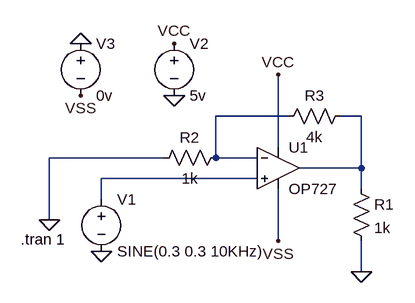
[diagram p0: schematic 6531313221-PB3.asc]
6531313221-PB3.asc, the LTspice schematic file:
Version 4
SHEET 1 880 680
WIRE 64 48 -48 48
WIRE 176 48 144 48
WIRE 48 96 48 -16
WIRE -128 112 -304 112
WIRE -48 112 -48 48
WIRE 16 112 -48 112
WIRE 176 128 176 48
WIRE 176 128 80 128
WIRE 16 144 -224 144
WIRE 176 160 176 128
WIRE -224 176 -224 144
WIRE -304 208 -304 112
WIRE 48 240 48 160
WIRE 176 288 176 240
FLAG 176 288 0
FLAG -304 208 0
FLAG 48 -16 VCC
FLAG -112 -64 VCC
FLAG -112 16 0
FLAG -256 -64 0
FLAG -256 16 VSS
FLAG -224 256 0
FLAG 48 240 VSS
SYMBOL res 160 144 R0
SYMATTR InstName R1
SYMATTR Value 1k
SYMBOL voltage -224 160 R0
WINDOW 123 0 0 Left 0
WINDOW 39 0 0 Left 0
SYMATTR InstName V1
SYMATTR Value SINE(0.3 0.3 10KHz)
SYMBOL voltage -112 -80 R0
WINDOW 123 0 0 Left 0
WINDOW 39 0 0 Left 0
SYMATTR InstName V2
SYMATTR Value 5v
SYMBOL Opamps\\OP727 48 64 R0
SYMATTR InstName U1
SYMBOL voltage -256 -80 R0
WINDOW 123 0 0 Left 0
WINDOW 39 0 0 Left 0
SYMATTR InstName V3
SYMATTR Value 0v
SYMBOL res -32 96 R90
WINDOW 0 0 56 VBottom 2
WINDOW 3 32 56 VTop 2
SYMATTR InstName R2
SYMATTR Value 1k
SYMBOL res 160 32 R90
WINDOW 0 0 56 VBottom 2
WINDOW 3 32 56 VTop 2
SYMATTR InstName R3
SYMATTR Value 4k
TEXT -348 238 Left 2 !.tran 1

The netlist it stands for:
* 6531313221-PB3.asc
R1 N002 0 1k
V1 N003 0 SINE(0.3 0.3 10KHz)
V2 VCC 0 5v
XU1 N003 N001 VCC VSS N002 OP727  ; pins In+ In- V+ V- OUT
V3 0 VSS 0v
R2 N001 0 1k
R3 N002 N001 4k
.tran 1
.backanno
.end